# Altium schematic sheet 原理图(Altium).SchDoc
size A4
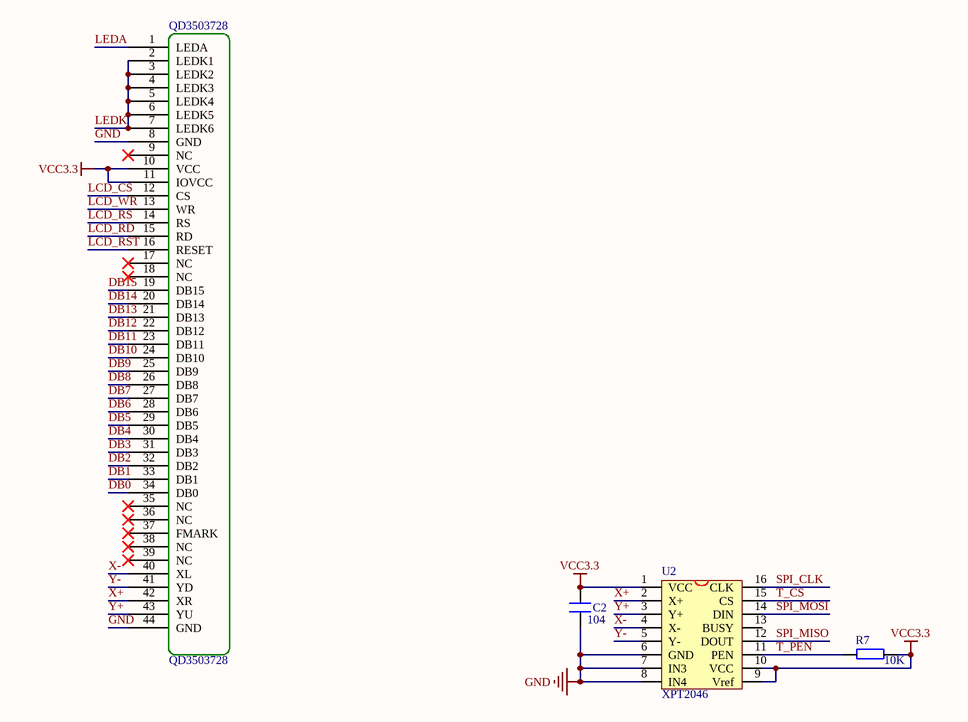
[diagram p0: 原理图(Altium).SchDoc]

## Parts
C2  104  [C0603]
QD3503728  QD3503728  [QD3503728]
R7  10K  [R0603]
U2  XPT2046  [SSOP16]

## Nets
GND: C2.2 QD3503728.8(GND) QD3503728.44(GND) U2.6(GND) U2.7(IN3) U2.8(IN4)
VCC3.3: C2.1 QD3503728.10(VCC) QD3503728.11(IOVCC) R7.1 U2.1(VCC) U2.9(Vref) U2.10(VCC)
DB0: QD3503728.34(DB0)
DB1: QD3503728.33(DB1)
DB2: QD3503728.32(DB2)
DB3: QD3503728.31(DB3)
DB4: QD3503728.30(DB4)
DB5: QD3503728.29(DB5)
DB6: QD3503728.28(DB6)
DB7: QD3503728.27(DB7)
DB8: QD3503728.26(DB8)
DB9: QD3503728.25(DB9)
DB10: QD3503728.24(DB10)
DB11: QD3503728.23(DB11)
DB12: QD3503728.22(DB12)
DB13: QD3503728.21(DB13)
DB14: QD3503728.20(DB14)
DB15: QD3503728.19(DB15)
LCD_CS: QD3503728.12(CS)
LCD_RD: QD3503728.15(RD)
LCD_RS: QD3503728.14(RS)
LCD_RST: QD3503728.16(RESET)
LCD_WR: QD3503728.13(WR)
LEDA: QD3503728.1(LEDA)
LEDK: QD3503728.2(LEDK1) QD3503728.3(LEDK2) QD3503728.4(LEDK3) QD3503728.5(LEDK4) QD3503728.6(LEDK5) QD3503728.7(LEDK6)
SPI_CLK: U2.16(CLK)
SPI_MISO: U2.12(DOUT)
SPI_MOSI: U2.14(DIN)
T_CS: U2.15(CS)
T_PEN: R7.2 U2.11(PEN)
X+: QD3503728.42(XR) U2.2(X+)
X-: QD3503728.40(XL) U2.4(X-)
Y+: QD3503728.43(YU) U2.3(Y+)
Y-: QD3503728.41(YD) U2.5(Y-)

Not connected (* = marked no-connect by the designer): QD3503728 9(NC)* 17(NC)* 18(NC)* 35(NC)* 36(NC)* 37(FMARK)* 38(NC)* 39(NC)*; U2 13(BUSY)

## Library data of the parts
C2 = C
R7 = R
U2 = ADS7843